# EAGLE design msp430f5528 (EAGLE 5.11)
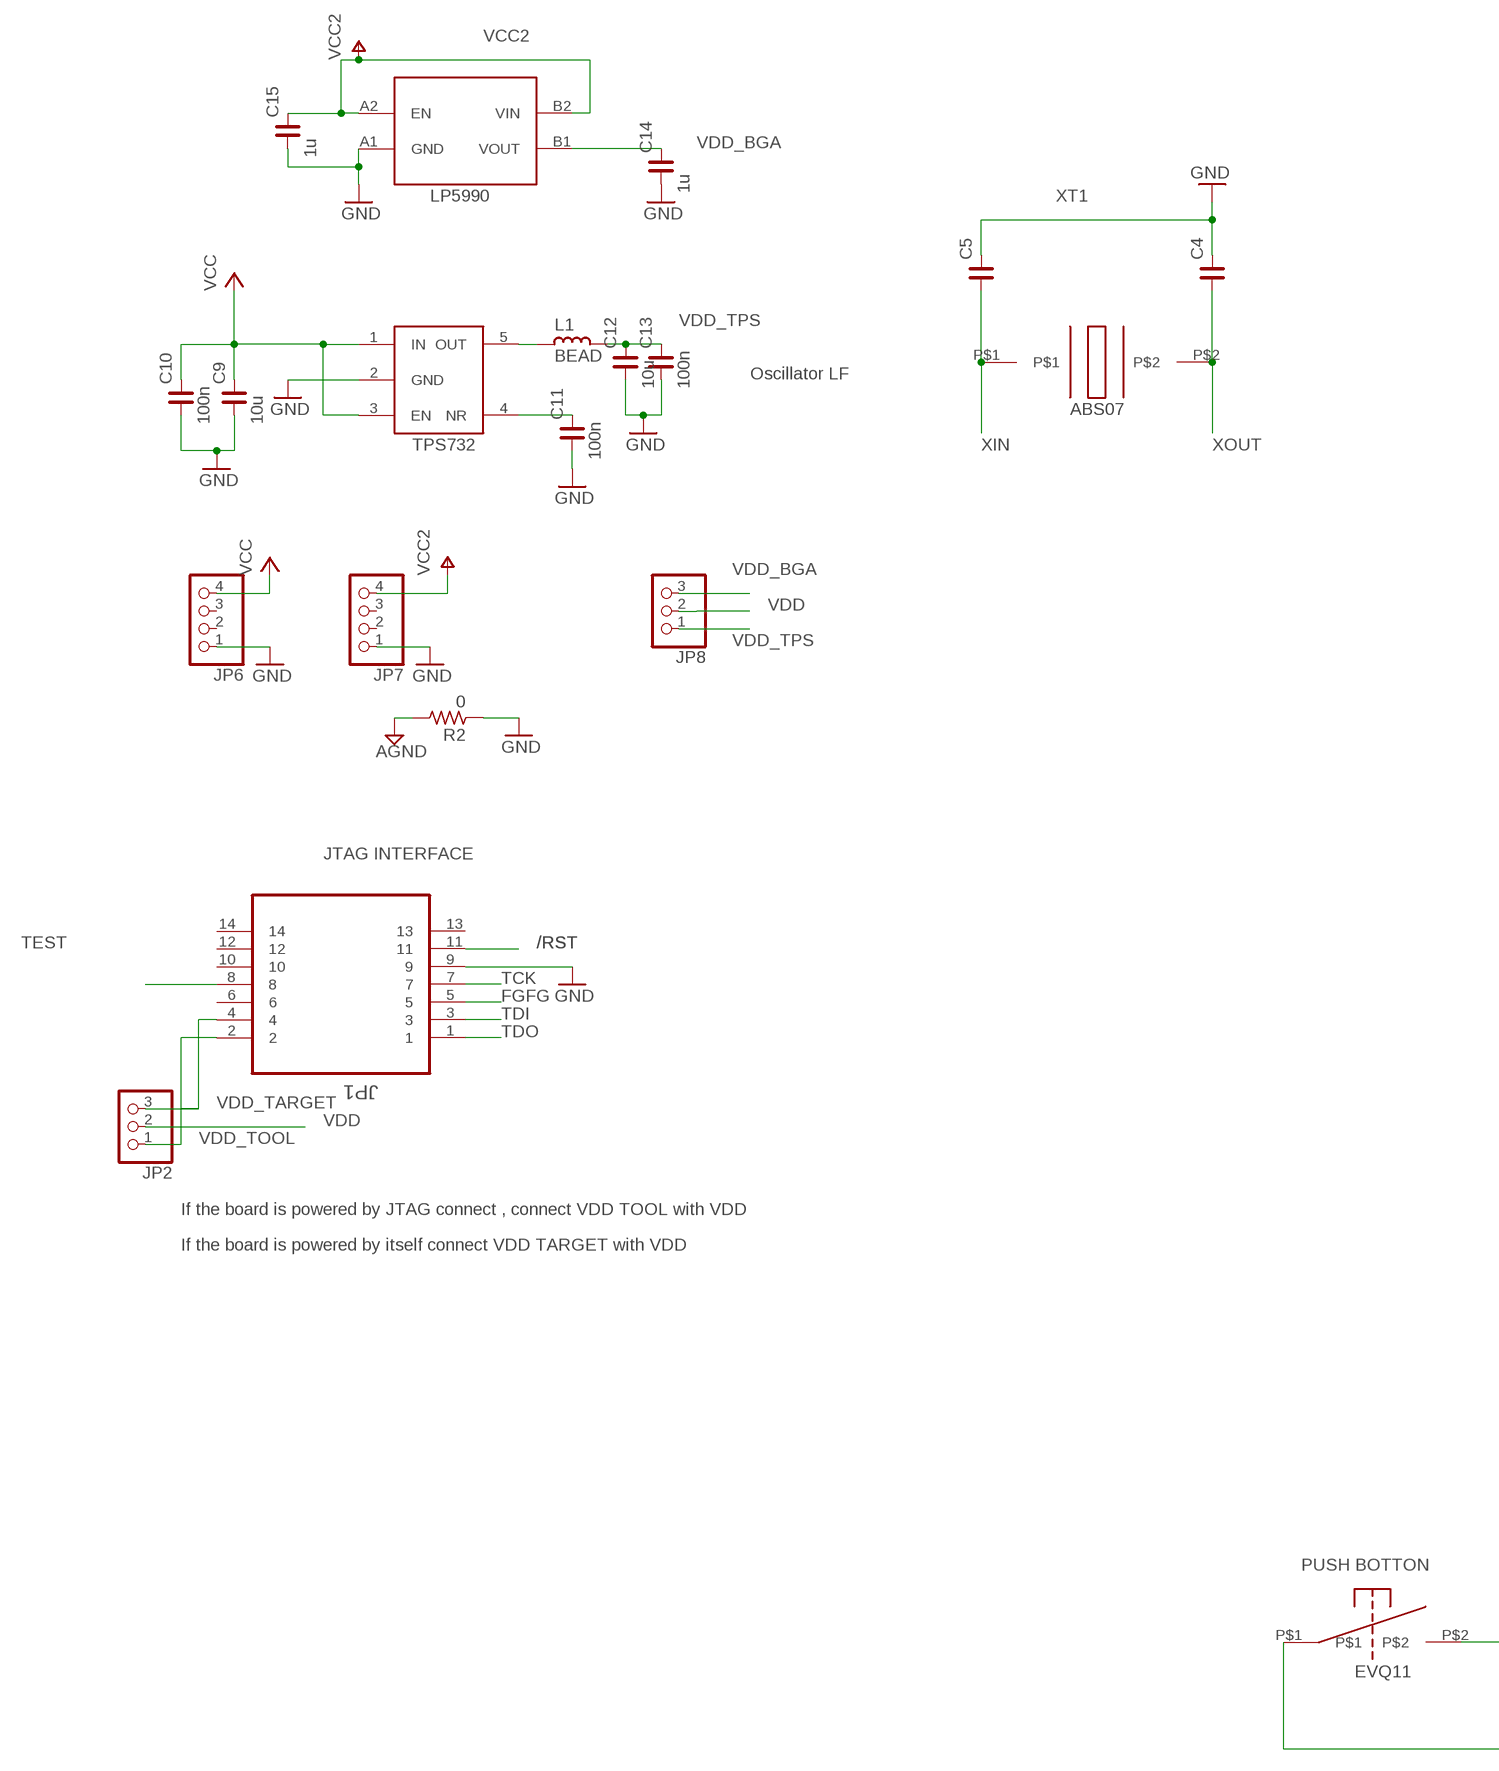
[diagram p0: schematic, sheet 1, part 1 of 2]
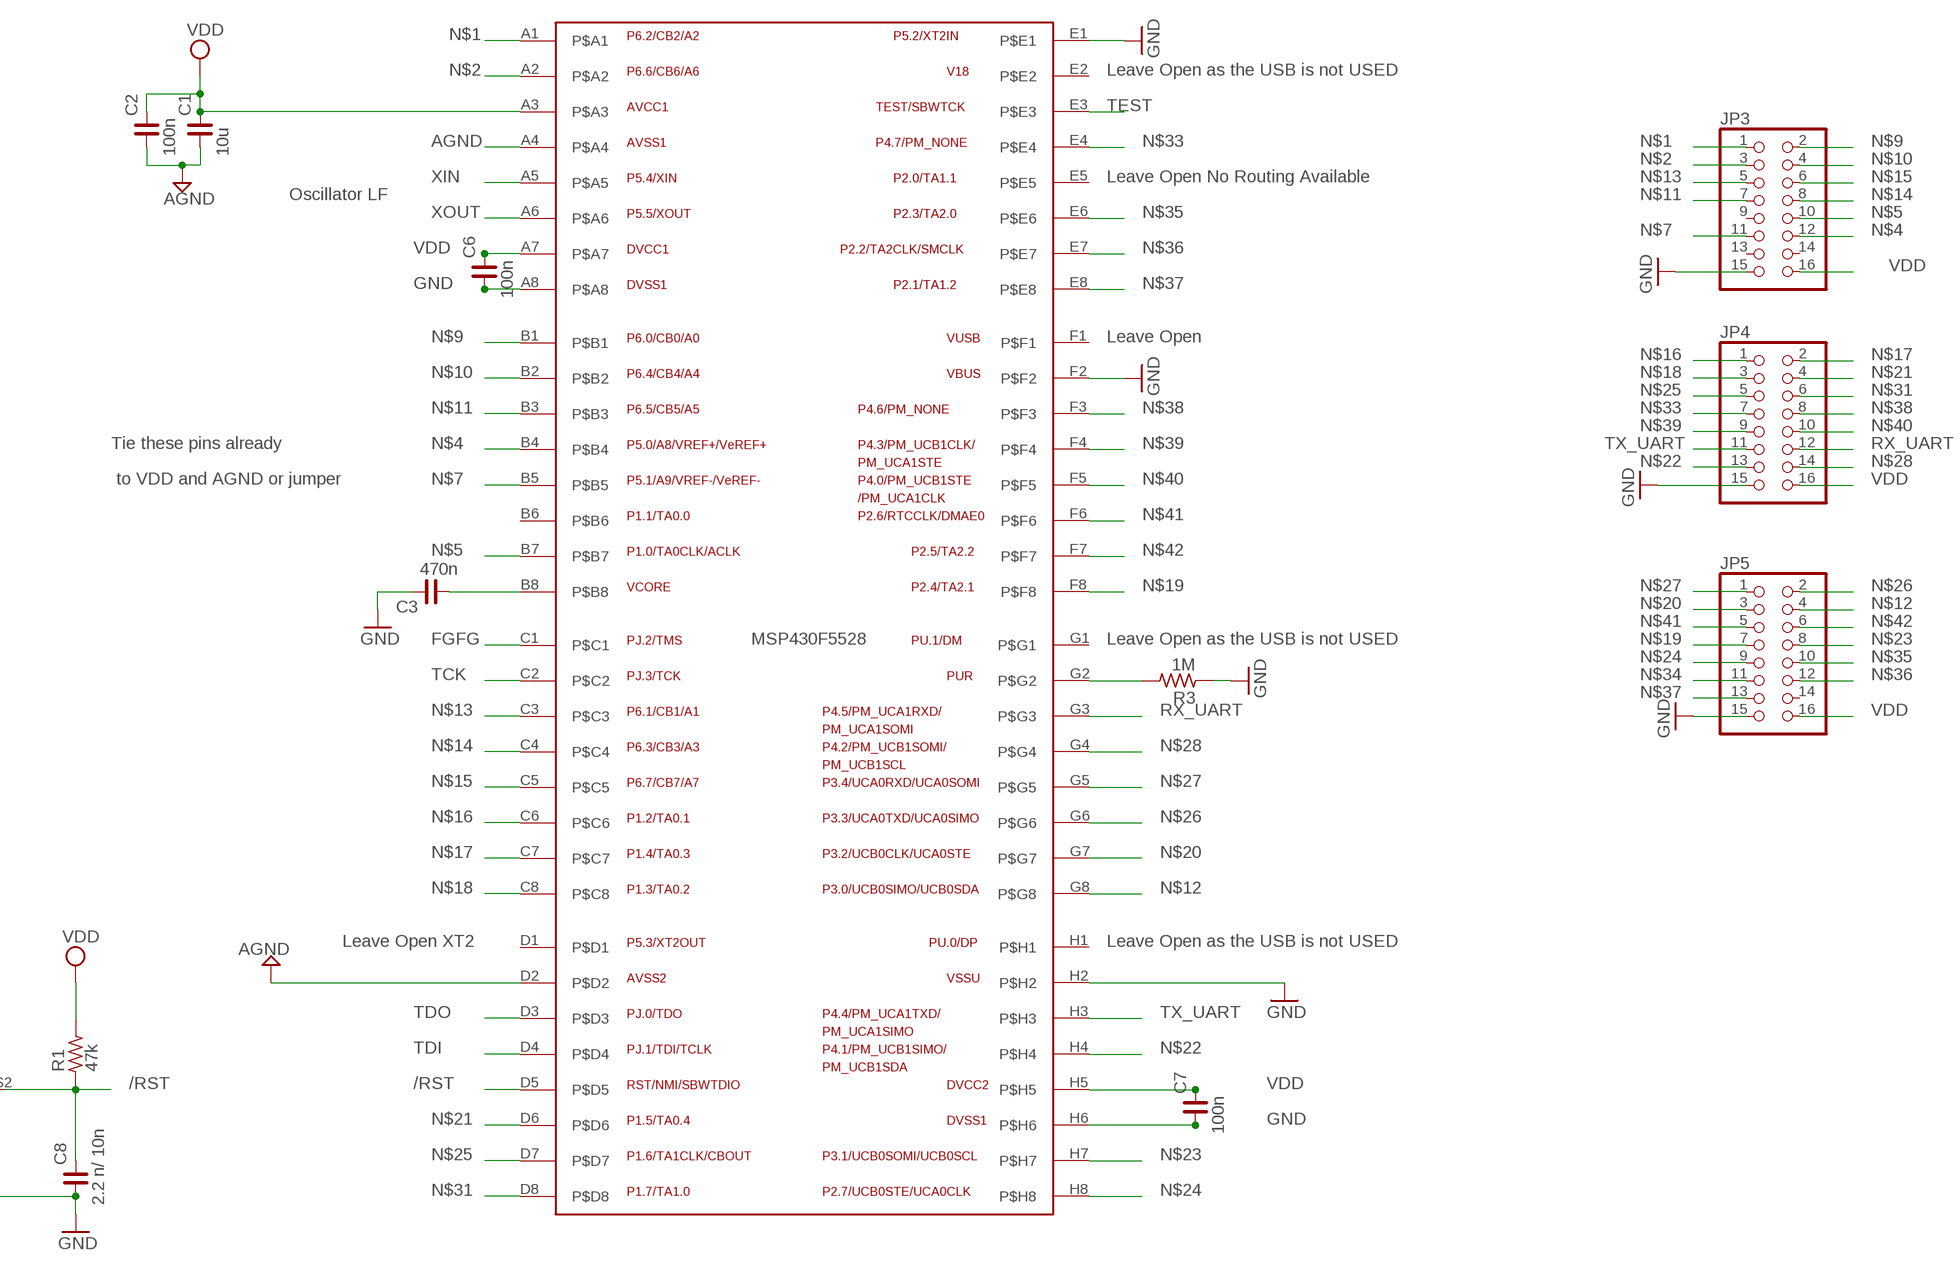
[diagram p1: schematic, sheet 1, part 2 of 2]

## Parts
C1  10u  C_0402  [C0402]
C2  100n  C_0201  [C0201]
C3  470n  C_0201  [C0201]
C4  C_0402  [C0402]
C5  C_0402  [C0402]
C6  100n  C_0201  [C0201]
C7  100n  C_0201  [C0201]
C8  2.2 n/ 10n  C_0201  [C0201]
C9  10u  C_0402  [C0402]
C10  100n  C_0201  [C0201]
C11  100n  C_0402  [C0402]
C12  10u  C_0201  [C0201]
C13  100n  C_0201  [C0201]
C14  1u  C_0402  [C0402]
C15  1u  C_0402  [C0402]
JP1  5103308-2  [TYCO_5103308-2]
JP2  PINHD-1X3  [1X03]
JP3  PINHD-2X8  [2X08]
JP4  PINHD-2X8  [2X08]
JP5  PINHD-2X8  [2X08]
JP6  PINHD-1X4  [1X04]
JP7  PINHD-1X4  [1X04]
JP8  PINHD-1X3  [1X03]
L1  BEAD  L_0402  [L0402]
R1  47k  R_0201  [R0201]
R2  0  R_0201  [R0201]
R3  1M  R_0201  [R0201]
TPS7323  TPS732XX  [SOT23]
U$1  MSP430F5528  [YFF64]
U$2  OSC32K  [ABS07]
U$3  LP5990  [XBGA4]
U$4  PUSH_BOT  [EVQ_11_TH]

## Nets
/RST: C8.2 JP1.11 R1.1 U$1.D5(P$D5) U$4.P$2
AGND: C1.1 C2.1 R2.2 U$1.A4(P$A4) U$1.D2(P$D2)
FGFG: JP1.5 U$1.C1(P$C1)
GND: C3.2 C4.2 C5.2 C6.1 C7.1 C8.1 C9.1 C10.1 C11.1 C12.1 C13.1 C14.1 C15.1 JP1.9 JP3.15 JP4.15 JP5.15 JP6.1 JP7.1 R2.1 R3.1 TPS7323.2(GND) U$1.A8(P$A8) U$1.E1(P$E1) U$1.F2(P$F2) U$1.H2(P$H2) U$1.H6(P$H6) U$3.A1(GND) U$4.P$1
N$1: JP3.1 U$1.A1(P$A1)
N$2: JP3.3 U$1.A2(P$A2)
N$3: C3.1 U$1.B8(P$B8)
N$4: JP3.12 U$1.B4(P$B4)
N$5: JP3.10 U$1.B7(P$B7)
N$7: JP3.11 U$1.B5(P$B5)
N$9: JP3.2 U$1.B1(P$B1)
N$10: JP3.4 U$1.B2(P$B2)
N$11: JP3.7 U$1.B3(P$B3)
N$12: JP5.4 U$1.G8(P$G8)
N$13: JP3.5 U$1.C3(P$C3)
N$14: JP3.8 U$1.C4(P$C4)
N$15: JP3.6 U$1.C5(P$C5)
N$16: JP4.1 U$1.C6(P$C6)
N$17: JP4.2 U$1.C7(P$C7)
N$18: JP4.3 U$1.C8(P$C8)
N$19: JP5.7 U$1.F8(P$F8)
N$20: JP5.3 U$1.G7(P$G7)
N$21: JP4.4 U$1.D6(P$D6)
N$22: JP4.13 U$1.H4(P$H4)
N$23: JP5.8 U$1.H7(P$H7)
N$24: JP5.9 U$1.H8(P$H8)
N$25: JP4.5 U$1.D7(P$D7)
N$26: JP5.2 U$1.G6(P$G6)
N$27: JP5.1 U$1.G5(P$G5)
N$28: JP4.14 U$1.G4(P$G4)
N$29: R3.2 U$1.G2(P$G2)
N$31: JP4.6 U$1.D8(P$D8)
N$33: JP4.7 U$1.E4(P$E4)
N$34: JP5.11
N$35: JP5.10 U$1.E6(P$E6)
N$36: JP5.12 U$1.E7(P$E7)
N$37: JP5.13 U$1.E8(P$E8)
N$38: JP4.8 U$1.F3(P$F3)
N$39: JP4.9 U$1.F4(P$F4)
N$40: JP4.10 U$1.F5(P$F5)
N$41: JP5.5 U$1.F6(P$F6)
N$42: JP5.6 U$1.F7(P$F7)
N$47: C11.2 TPS7323.4(NR)
N$48: L1.2 TPS7323.5(OUT)
RX_UART: JP4.12 U$1.G3(P$G3)
TCK: JP1.7 U$1.C2(P$C2)
TDI: JP1.3 U$1.D4(P$D4)
TDO: JP1.1 U$1.D3(P$D3)
TEST: JP1.8 U$1.E3(P$E3)
TX_UART: JP4.11 U$1.H3(P$H3)
VCC: C9.2 C10.2 JP6.4 TPS7323.1(IN) TPS7323.3(EN)
VCC2: C15.2 JP7.4 U$3.A2(EN) U$3.B2(VIN)
VDD: C1.2 C2.2 C6.2 C7.2 JP2.2 JP3.16 JP4.16 JP5.16 JP8.2 R1.2 U$1.A3(P$A3) U$1.A7(P$A7) U$1.H5(P$H5)
VDD_BGA: C14.2 JP8.3 U$3.B1(VOUT)
VDD_TARGET: JP1.4 JP2.3
VDD_TOOL: JP1.2 JP2.1
VDD_TPS: C12.2 C13.2 JP8.1 L1.1
XIN: C5.1 U$1.A5(P$A5) U$2.P$1
XOUT: C4.1 U$1.A6(P$A6) U$2.P$2
Unconnected: JP1.6 JP1.10 JP1.12 JP1.13 JP1.14 JP3.9 JP3.13 JP3.14 JP5.14 JP6.2 JP6.3 JP7.2 JP7.3 U$1.B6(P$B6) U$1.D1(P$D1) U$1.E2(P$E2) U$1.E5(P$E5) U$1.F1(P$F1) U$1.G1(P$G1) U$1.H1(P$H1)

## Notes on the sheet
- XT1
- Oscillator LF
- Leave Open as the USB is not USED
- Leave Open No Routing Available
- Oscillator LF
- JTAG INTERFACE
- Leave Open
- Tie these pins already
- to VDD and AGND or jumper
- Leave Open as the USB is not USED
- If the board is powered by JTAG connect , connect VDD TOOL with VDD
- If the board is powered by itself connect VDD TARGET with VDD
- Leave Open XT2 | Leave Open as the USB is not USED
- PUSH BOTTON

## Library data of the parts
C1-C15 = rc-master-smd:C_: NON-POLARIZED CAP
JP1 = TE_CONNECTOR:5103308-2: HEADER, 2.54MM, 14WAY; MPN: 5103308-2; OC_FARNELL: 1772816; OC_NEWARK: 73K2063; PACKAGE: HEADER, 2.54MM, 14WAY; SUPPLIER: Tyco Electronics
JP2 JP8 = pinhead:PINHD-1X3: PIN HEADER
JP3-JP5 = pinhead:PINHD-2X8: PIN HEADER
JP6 JP7 = pinhead:PINHD-1X4: PIN HEADER
L1 = rc-master-smd:L_: INDUCTOR
R1-R3 = rc-master-smd:R_: RESISTOR
TPS7323 = TPS732xx:TPS732XX
U$1 = msp430f5528:MSP430F5528
U$2 = ABS07:OSC32K
U$3 = LP5990:LP5990
U$4 = push_botton:PUSH_BOT

## Board
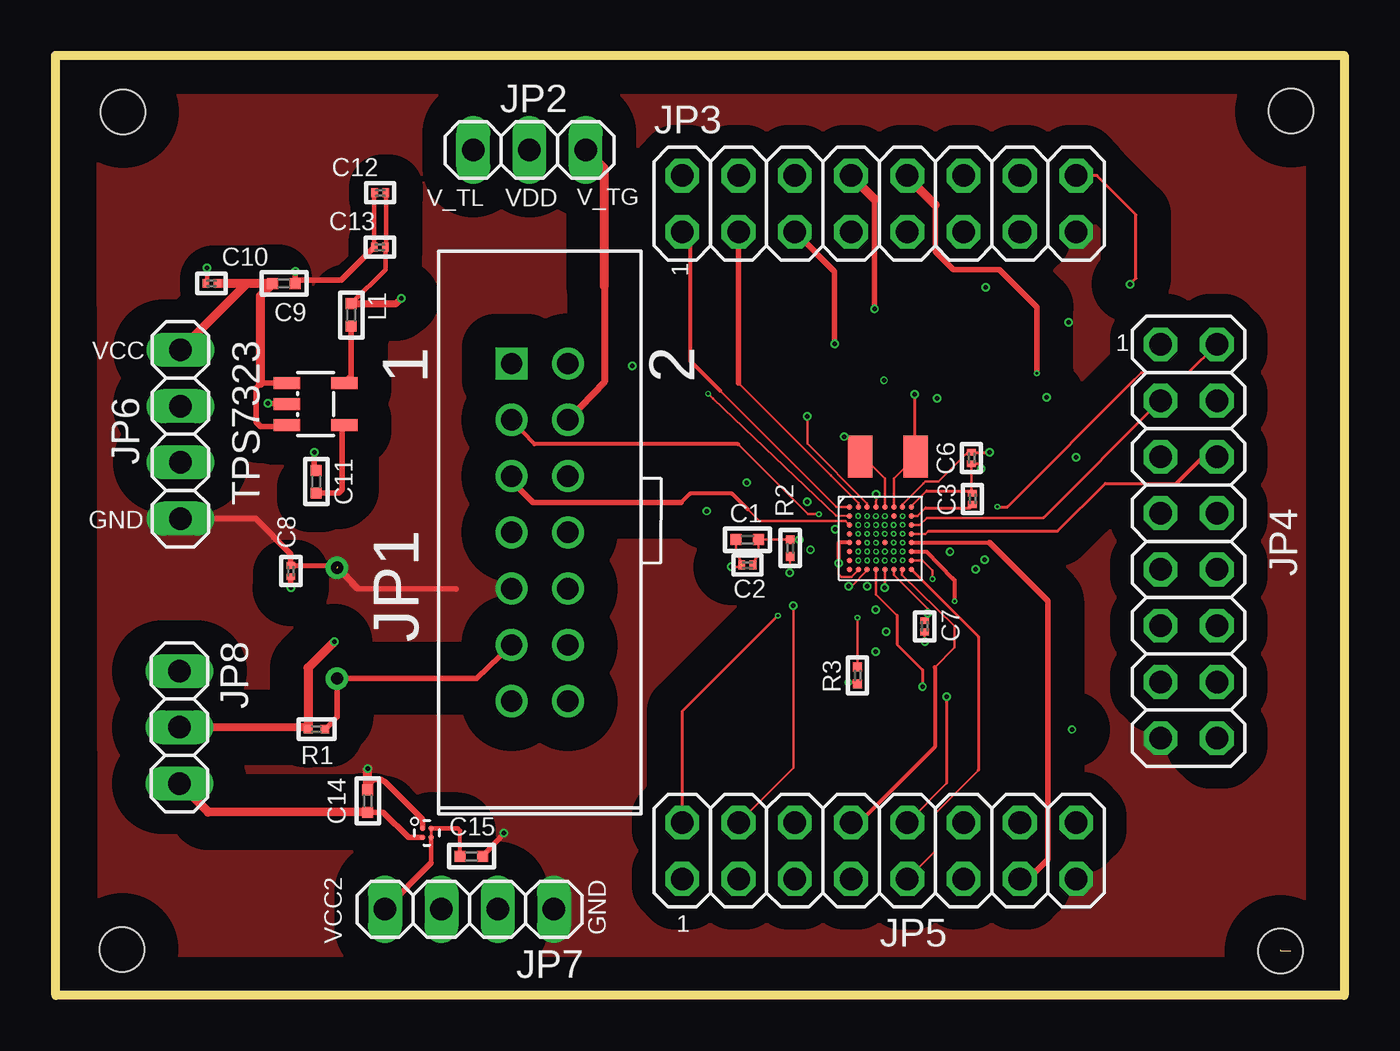
[diagram p2: board, top side]
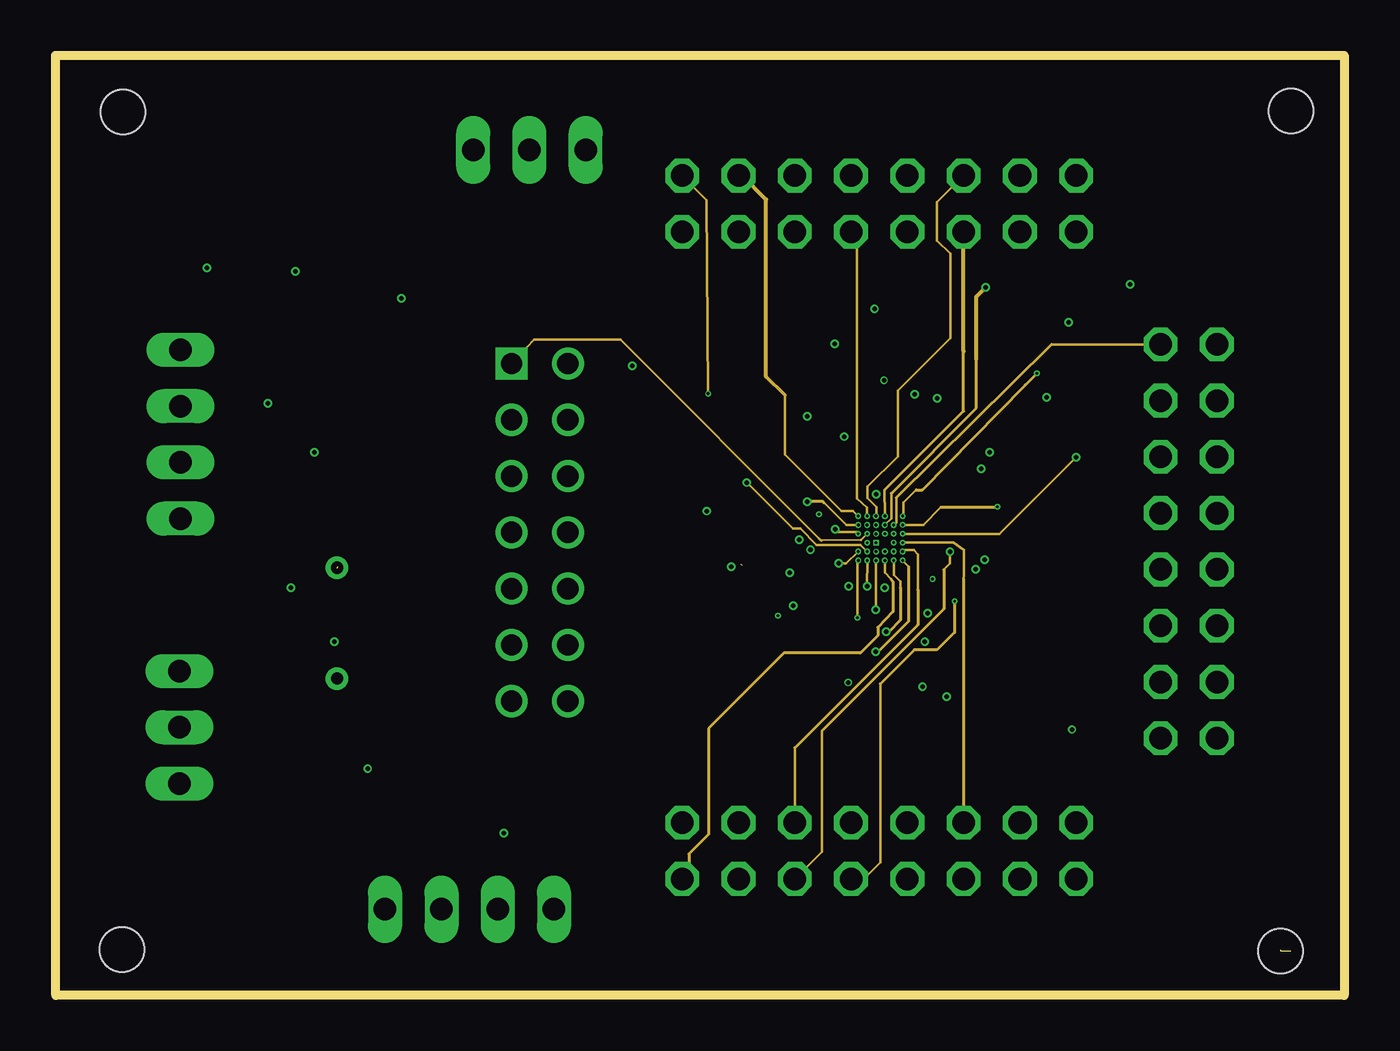
[diagram p3: board, inner layer Route2]
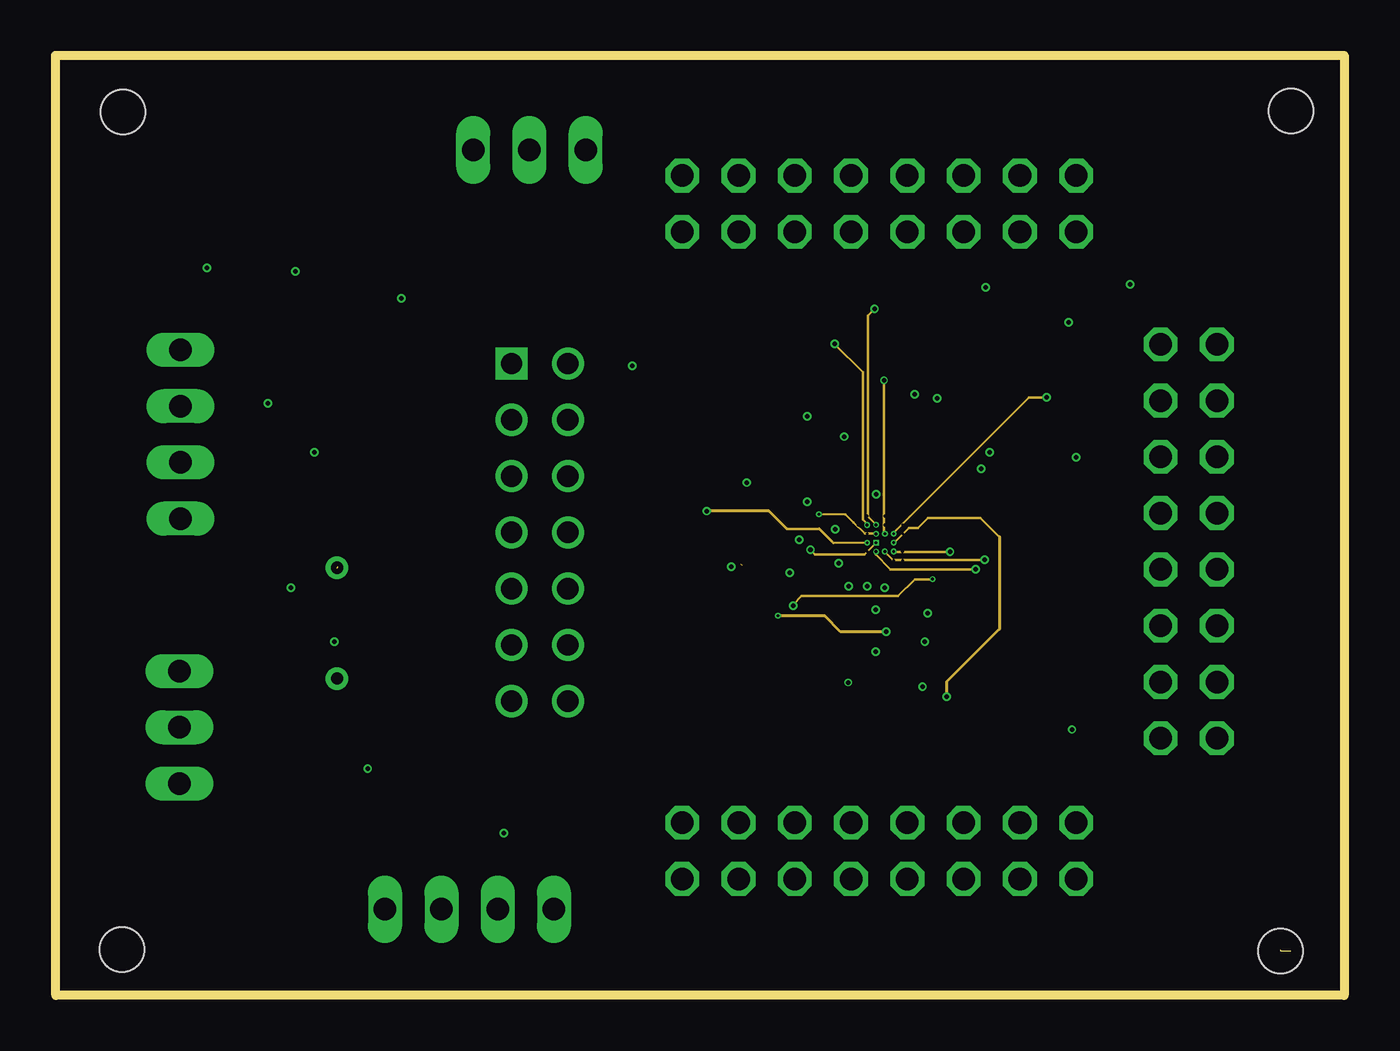
[diagram p4: board, inner layer Route3]
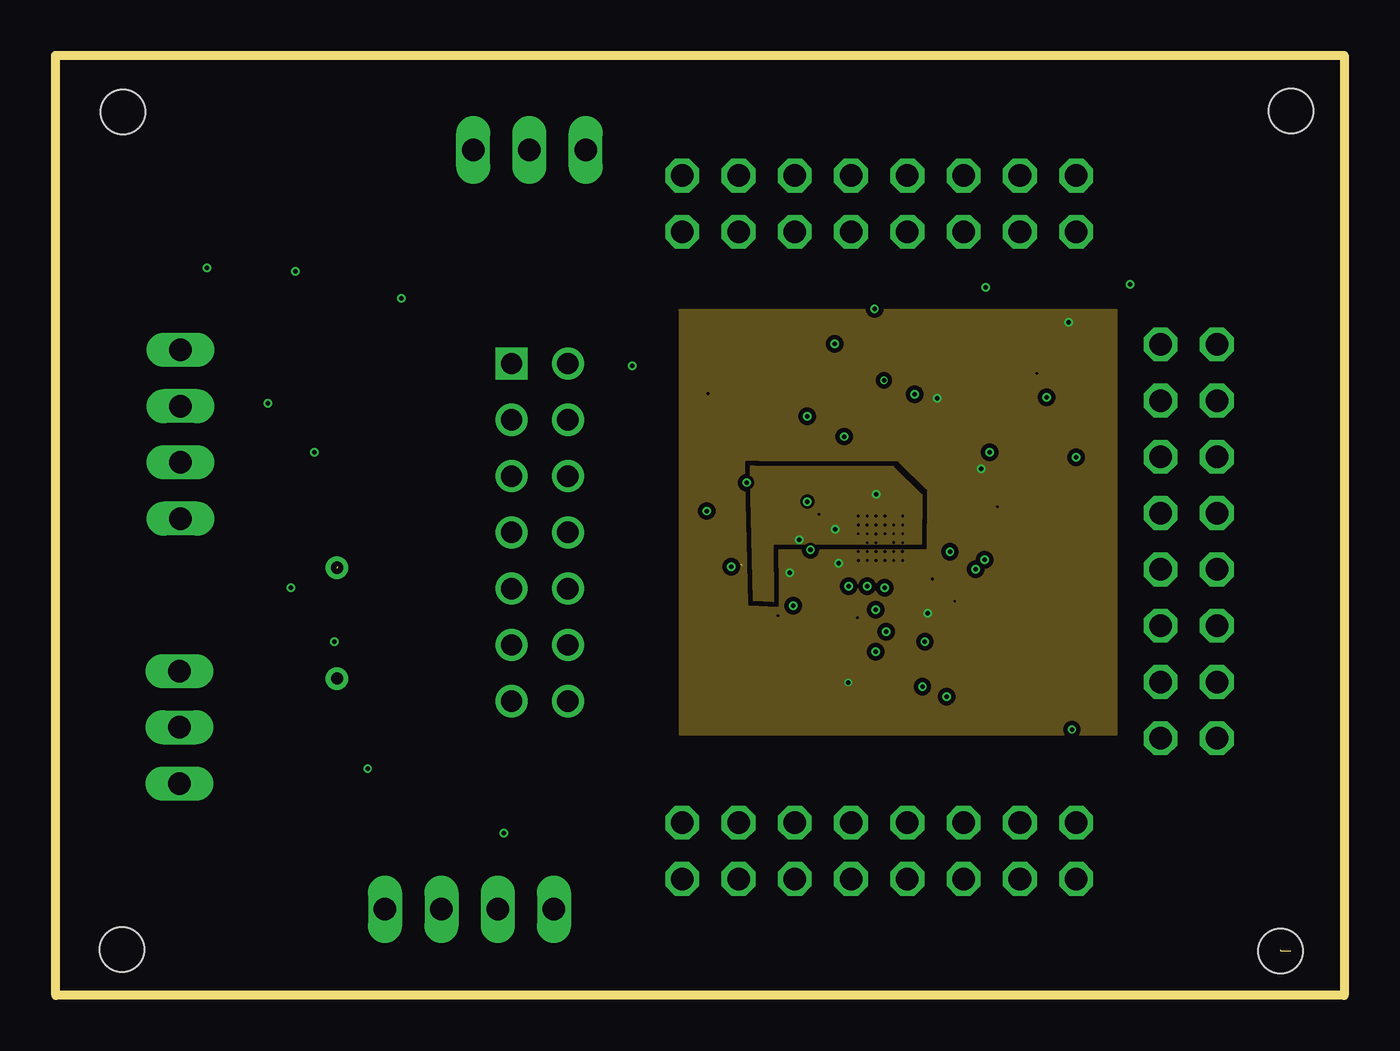
[diagram p5: board, inner layer Route14]
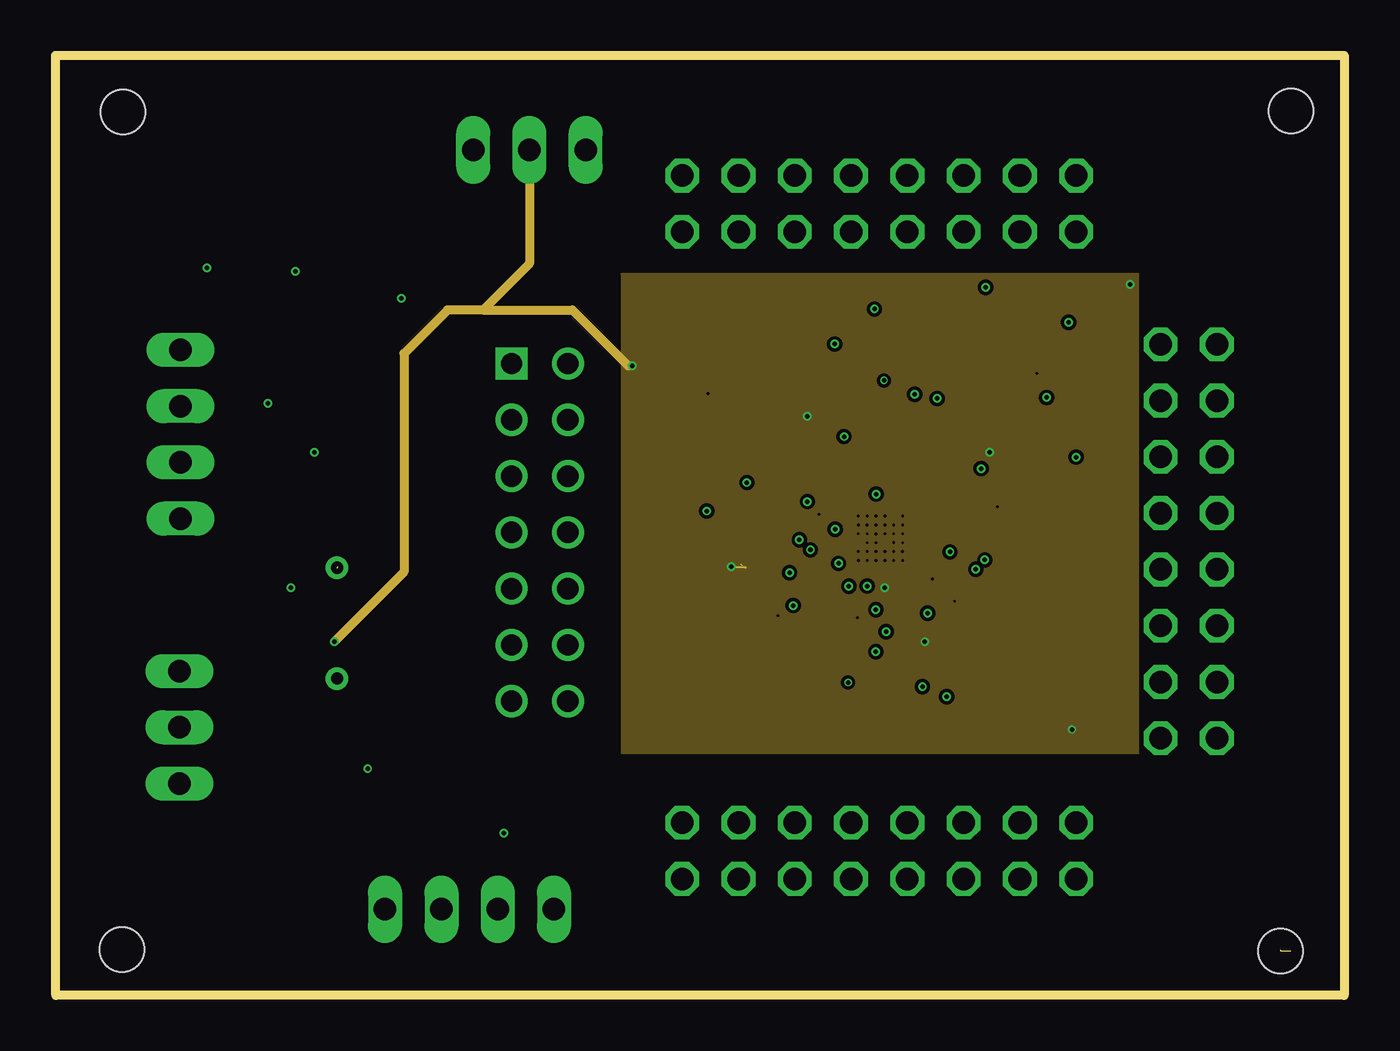
[diagram p6: board, inner layer Route15]
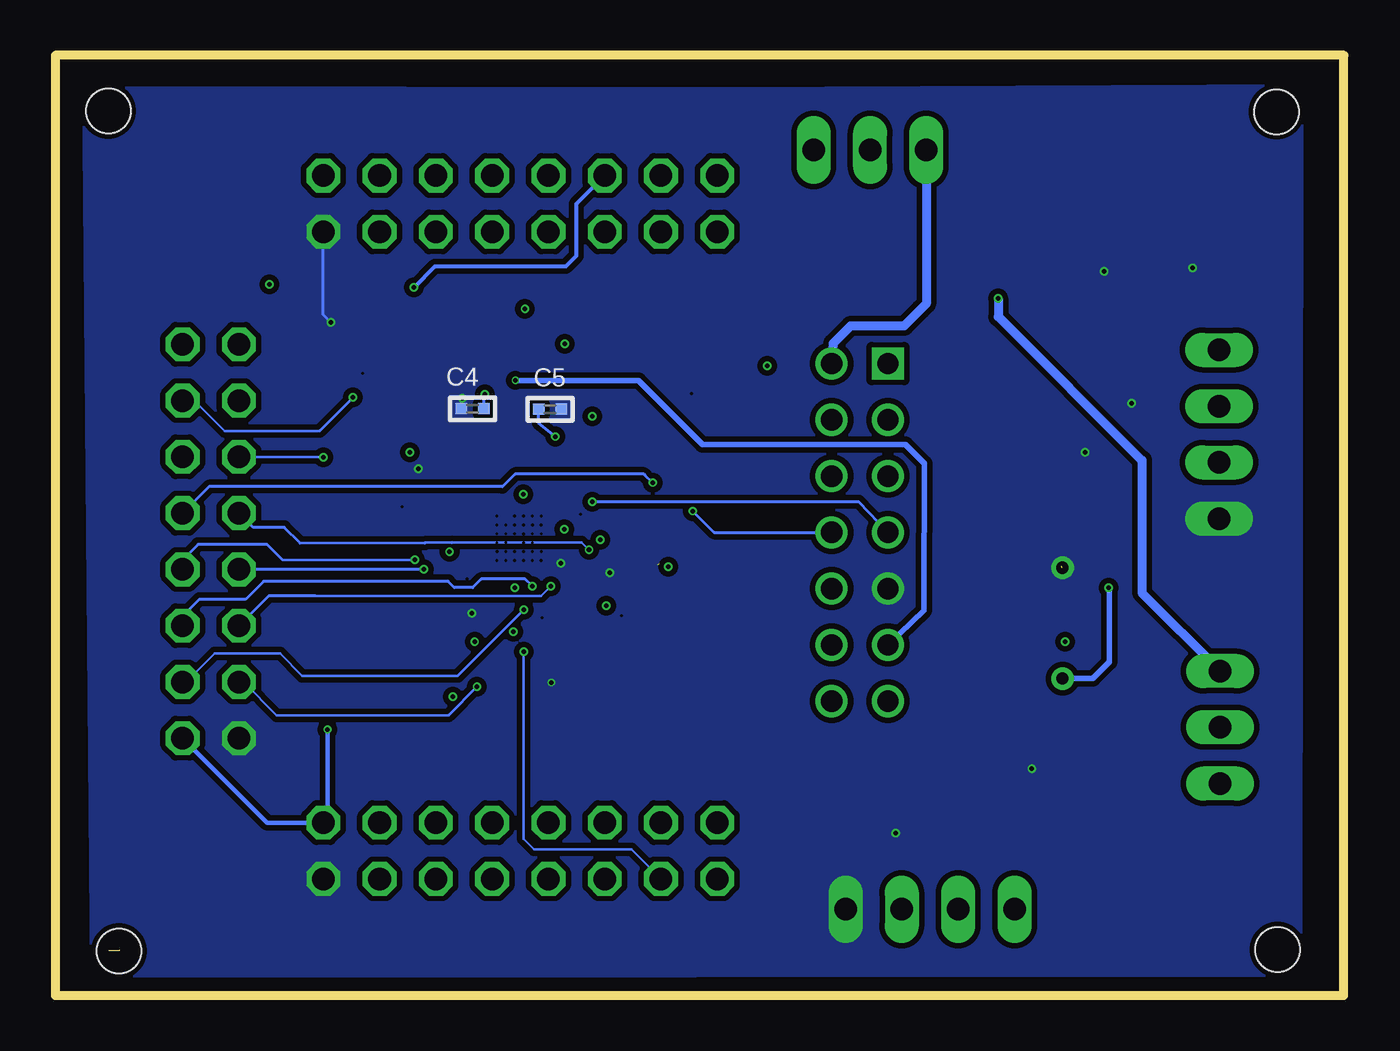
[diagram p7: board, bottom side, seen from below]

Size 58.17 x 42.44 mm. Coordinates in mm from the lower left corner, seen from the top.
Outline: 0,42.44 58.17,42.44 58.17,0 0.02,0 0.02,42.42
Outline: 55.28,2.07 55.28,2.02 55.75,2.02
Copper layers ([2:1+[3:2+(3*14)+15:14]+16:15]): Top 0.025mm / dielectric 0.1mm / Route2 0.022mm / dielectric 0.13mm / Route3 0.022mm / dielectric 0.1mm / Route14 0.022mm / dielectric 0.13mm / Route15 0.022mm / dielectric 0.13mm / Bottom 0.025mm
Design rules "6default *": minimum track width 4mil, minimum drill 5mil, track to track 0.1041mm, track to pad 4mil, pad to pad 4mil, via to via 4mil, smd to smd 0mil, copper to edge 0.1mm, drill to drill 0.1mm, minimum pad ring 2.5mil, minimum via ring 2.5mil, stop-mask expansion 0mil, vias tented up to drill 3mm, thermal gap 0mil
Holes 2 mm at 3.05,39.89 55.78,39.93 55.3,2.01 3.01,2.08

### Footprints (pad centres in the part's own frame; a part is rotated, then mirrored left to right if it is on the bottom)
C0402 = smd 0.5 x 0.5: 1 -0.508,0; 2 0.508,0
C0201 = smd 0.3 x 0.4: 1 -0.254,0; 2 0.254,0
TYCO_5103308-2 = drill 0.965 square: 1 0,2.54 | drill 0.965 round: 2 0,0; 3 -2.54,2.54; 4 -2.54,0; 5 -5.08,2.54; 6 -5.08,0; 7 -7.62,2.54; 8 -7.62,0; 9 -10.16,2.54; 10 -10.16,0; 11 -12.7,2.54; 12 -12.7,0; 13 -15.24,2.54; 14 -15.24,0
1X03 = drill 1.016 long: 1 -2.54,0; 2 0,0; 3 2.54,0
2X08 = drill 1.016 octagon: 1 -8.89,-1.27; 2 -8.89,1.27; 3 -6.35,-1.27; 4 -6.35,1.27; 5 -3.81,-1.27; 6 -3.81,1.27; 7 -1.27,-1.27; 8 -1.27,1.27; 9 1.27,-1.27; 10 1.27,1.27; 11 3.81,-1.27; 12 3.81,1.27; 13 6.35,-1.27; 14 6.35,1.27; 15 8.89,-1.27; 16 8.89,1.27
1X04 = drill 1.016 long: 1 -3.81,0; 2 -1.27,0; 3 1.27,0; 4 3.81,0
L0402 = smd 0.5 x 0.5: 1 -0.508,0; 2 0.508,0
R0201 = smd 0.4 x 0.4: 1 -0.381,0; 2 0.381,0
SOT23 = smd 0.55 x 1.2: 1 -0.95,-1.3; 2 0,-1.3; 3 0.95,-1.3; 4 0.95,1.3; 5 -0.95,1.3
YFF64 = smd 0.25 x 0.25: A1 -1.4,1.4; A2 -1,1.4; A3 -0.6,1.4; A4 -0.2,1.4; A5 0.2,1.4; A6 0.6,1.4; A7 1,1.4; A8 1.4,1.4; B1 -1.4,1; B2 -1,1; B3 -0.6,1; B4 -0.2,1; B5 0.2,1; B6 0.6,1; B7 1,1; B8 1.4,1; C1 -1.4,0.6; C2 -1,0.6; C3 -0.6,0.6; C4 -0.2,0.6; C5 0.2,0.6; C6 0.6,0.6; C7 1,0.6; C8 1.4,0.6; D1 -1.4,0.2; D2 -1,0.2; D3 -0.6,0.2; D4 -0.2,0.2; D5 0.2,0.2; D6 0.6,0.2; D7 1,0.2; D8 1.4,0.2; E1 -1.4,-0.2; E2 -1,-0.2; E3 -0.6,-0.2; E4 -0.2,-0.2; E5 0.2,-0.2; E6 0.6,-0.2; E7 1,-0.2; E8 1.4,-0.2; F1 -1.4,-0.6; F2 -1,-0.6; F3 -0.6,-0.6; F4 -0.2,-0.6; F5 0.2,-0.6; F6 0.6,-0.6; F7 1,-0.6; F8 1.4,-0.6; G1 -1.4,-1; G2 -1,-1; G3 -0.6,-1; G4 -0.2,-1; G5 0.2,-1; G6 0.6,-1; G7 1,-1; G8 1.4,-1; H1 -1.4,-1.4; H2 -1,-1.4; H3 -0.6,-1.4; H4 -0.2,-1.4; H5 0.2,-1.4; H6 0.6,-1.4; H7 1,-1.4; H8 1.4,-1.4
ABS07 = smd 1.1 x 1.9: P$1 -1.25,0; P$2 1.25,0
XBGA4 = smd 0.25 x 0.25: A1 -0.2,-0.2; A2 -0.2,0.2; B1 0.2,-0.2; B2 0.2,0.2
EVQ_11_TH = drill 0.55 pad 1.016 round: P$1 -2.5,0; P$2 2.5,0

### Placement (x,y rotation side)
C1  31.23,20.58 180 top
C2  31.23,19.43 180 top
C3  41.39,22.42 90 top
C4  39.34,26.49 180 bottom
C5  35.84,26.47 0 bottom
C6  41.35,24.26 90 top
C7  39.23,16.66 270 top
C8  10.63,19.16 270 top
C9  10.32,32.14 180 top
C10  7.05,32.15 0 top
C11  11.77,23.19 270 top
C12  14.66,36.24 0 top
C13  14.64,33.78 0 top
C14  14.1,8.78 270 top
C15  18.78,6.29 180 top
JP1  23.13,28.53 90 top
JP2  21.4,38.17 0 top
JP3  37.18,35.74 0 top
JP4  51.15,20.5 270 top
JP5  37.18,6.53 0 top
JP6  5.64,25.34 90 top
JP7  18.69,3.89 180 top
JP8  5.6,12.11 270 top
L1  13.35,30.72 270 top
R1  11.78,12.02 180 top
R2  33.17,20.2 90 top
R3  36.21,14.45 90 top
TPS7323  11.74,26.7 270 top
U$1  37.24,20.64 0 top
U$2  37.58,24.33 0 top
U$3  16.77,7.34 270 top
U$4  12.71,16.81 270 top

### Tracks (layer width: path | path; a pad name or v marks a point on that pad's centre or on a via)
/RST  (via drill 0.13 pad 0.25 layers 1-2, 0.13 pad 0.25 layers 2-3, 0.2, 0.2 pad 0.38)
  Top 0.102: U$1.D5 v37.44,20.84
  Top 0.127: C8.2
  Top 0.254: R1.1 12.71,12.57 U$4.P$2 19.01,14.31 JP1.11 | v10.62,18.41 C8.2
  Route2 0.102: v37.44,20.84 U$1.D5
  Route3 0.089: v37.4,27.76
  Route3 0.102: U$1.D5 37.4,20.89 37.4,20.98 37.4,21.01 v37.4,27.76
  Bottom 0.127: 10.6,18.38 v10.62,18.41
  Bottom 0.254: v37.4,27.76 31.85,27.76 28.95,24.86 19.79,24.86 18.95,24.02 18.96,17.76 18.96,17.39 JP1.11 | 10.6,18.38 10.6,15.05 11.34,14.31 U$4.P$2
  other vias: 37.44,20.84
AGND  (via drill 0.13 pad 0.25 layers 1-2, 0.2 pad 0.38)
  Top 0.076: R2.2
  Top 0.102: U$1.A4 v37.05,22.63 | R2.2 32.31,20.58 C1.1 31.74,20 C2.1 | U$1.D2 | U$1.D2 v36.24,20.84 | R2.2 v33.58,20.57
  Top 0.135: R2.2
  Route2 0.102: v36.23,20.84 36.16,20.91 35.34,20.91 v35.2,21.05
  Route2 0.127: v36.24,20.84 v36.23,20.84
  Bottom 0.102: v37.05,22.63 37.04,22.5 v37.05,22.63
  pour Route14 (isolate 0.127, rank 2): 31.43,22.51 31.53,17.86 32.38,17.81 32.36,20.4 39.06,20.4 39.08,22.59 37.8,23.86 31.54,23.88 31.4,23.87 31.41,22.96
FGFG
  Top 0.089: U$1.C1 35.83,21.25
  Top 0.102: 31.24,21.96 31.78,21.42 35.28,21.42 35.66,21.42 U$1.C1
  Top 0.178: 28.24,22.26 28.65,22.66 30.54,22.66 31.24,21.96
  Top 0.254: JP1.5 20.53,23.3 21.56,22.26 28.24,22.26
GND  (via drill 0.13 layers 1-2, 0.2 pad 0.25, 0.2 pad 0.38)  (1 unrouted)
  Top 0.076: v10.82,32.68 v10.83,32.69
  Top 0.089: C7.1 39.25,16.93
  Top 0.102: U$1.A8 38.64,22.1 39.32,22.78 | U$1.H2 36.26,19.27 36.26,19.22 35.93,18.89 35.48,18.89 35.35,19.03 v35.35,19.51 | U$1.F2 v36.24,20.04 | U$1.H6 37.84,18.99 39.37,17.46 v39.37,17.26 39.37,17.06 C7.1 | 41.39,22.78 41.35,22.82 C6.1 | R2.1 33.16,19.11 v33.14,19.08
  Top 0.127: 39.32,22.78 41.39,22.78 C3.2 | v45.73,30.38 45.72,30.38 45.71,30.39 | C6.1 41.78,24.01 v41.78,23.79 | R3.1 36.15,14.13 v35.78,14.13 | U$4.P$1 12.64,19.38
  Top 0.178: U$1.E1 35.35,20.44 v35.35,19.51
  Top 0.203: C11.1 11.64,23.83 | C10.1 6.84,32.12 v6.84,32.84 | 10.97,32.29 C9.1 | 14.39,36.22 C13.1
  Top 0.254: 18.09,18.36 13.59,18.37 U$4.P$1 | 12.64,19.38 C8.1 10.63,19.94 9.04,21.52 JP6.1 | C9.1 v10.82,32.68 | C12.1 14.39,36.22 | 12.76,19.36 13.64,18.43 | v11.68,24.53 11.68,23.79 arc90 C11.1 | v9.6,26.72 10.41,26.72 arc-90 TPS7323.2 | C15.1 20.22,7.3 v20.25,7.33 | U$3.A1 16.57,7.95 14.88,9.64 arc138 C14.1 | 10.97,32.29 12.9,32.29 C13.1
  Top 0.406: v14.09,10.25 v14.1,10.24 C14.1
  Route2 0.089: v36.23,20.05 v36.24,20.04
  Route2 0.102: v36.23,20.05 35.69,19.51 v35.35,19.51
  Bottom 0.102: C4.2 39.77,26.57
  Bottom 0.127: JP3.15 46.07,30.73 v45.73,30.38 | 39.77,26.57 39.8,26.6 v39.8,26.95
  Bottom 0.203: v6.84,32.84 6.84,32.8
  pour Bottom (isolate 0.25): 27.73,40.93 56.92,40.98 56.55,0.87 1.93,0.92 1.88,41.08
  pour Route14 (isolate 0.203, rank 3): 28.18,30.93 47.89,30.93 47.89,11.79 28.19,11.79 28.19,30.91
  pour Top (isolate 1.524, rank 2): 27.8,40.99 56.98,41.05 56.61,0.93 1.99,0.98 1.94,41.14
N$1
  Top 0.102: U$1.A1 35.25,22.05 30.02,27.29
  Top 0.178: 30.02,27.29 28.66,28.64 28.66,29.19 28.66,34.1 JP3.1
N$2
  Top 0.102: U$1.A2 36.24,22.24 35,23.48 30.83,27.65
  Top 0.254: 30.83,27.65 JP3.3
N$3
  Top 0.102: U$1.B8 38.91,21.64 39.28,22.01
  Top 0.127: 39.28,22.01 39.28,22.02 41.24,22.02
  Top 0.178: 41.24,22.02 C3.1
N$4  (via drill 0.13 pad 0.25 layers 1-2)
  Top 0.102: U$1.B4 v37.04,21.64
  Route2 0.102: v37.04,21.64 37.03,21.65 37.05,21.6 37.05,22.05 36.65,22.45 36.65,22.96 36.66,22.97 38.02,24.33 38.02,24.45 38.02,27.31 40.39,29.68 40.39,33.48 39.8,34.07 39.8,35.82 JP3.12
N$5  (via drill 0.13 layers 1-2, 0.13 pad 0.25 layers 1-2)
  Top 0.102: U$1.B7 38.23,21.63 | U$1.B7 | JP3.10
  Top 0.127: 38.45,36.95 JP3.10
  Top 0.254: 39.72,35.68 39.72,33.57 40.52,32.77 42.62,32.77 44.3,31.09 v44.3,28.08
  Top 0.406: 39.72,35.68 38.45,36.95
  Route2 0.102: U$1.B7 38.27,21.67 38.27,22.25 38.84,22.83
  Route2 0.127: 38.84,22.83 39.12,22.83 43.78,27.56 v44.3,28.08
  other vias: 38.24,21.64
N$6
  pour Top (isolate 1.27): 11.15,27.82 12.34,27.82 12.34,25.08 11.14,25.08 11.14,27.81
  pour Top (isolate 2.032): 10.78,33.16 10.78,34.36 13.51,34.36 13.51,33.15 10.78,33.15
  pour Top (isolate 3.048): 14.6,19.65 13.4,19.65 13.4,22.39 14.6,22.39 14.6,19.66
N$7  (via drill 0.13 pad 0.25 layers 1-2)
  Top 0.102: U$1.B5
  Route2 0.1: U$1.B5
  Route2 0.102: 37.43,22.82 37.43,21.71 U$1.B5
  Route2 0.127: 40.99,29.08 40.99,26.38 37.43,22.82
  Route2 0.178: 40.99,29.08 JP3.11
  other vias: 37.44,21.64
N$8
  pour Top (isolate 1.27): 34.58,22.93 40.24,22.94 40.23,17.98 34.53,17.99 34.59,22.69
  pour Top (isolate 2.032): 44.79,33.53 47.57,33.53 47.55,28.75 44.76,28.69 44.79,33.29
  pour Top (isolate 3.81): 7.89,17.76 10.68,17.76 10.66,12.97 7.86,12.91 7.89,17.52
  pour Top (isolate 3.81): 7.73,9.63 7.64,10.56 12.42,10.54 12.59,9.56 7.99,9.6
N$9  (via drill 0.13 pad 0.25 layers 1-2)
  Top 0.102: U$1.B1 35.23,21.66 29.69,26.94 v29.46,27.17
  Route2 0.102: JP3.2 29.4,35.91 v29.46,27.17
N$10  (via drill 0.13 pad 0.25 layers 1-2)
  Top 0.102: U$1.B2 | U$1.B2 v36.23,21.65 v36.23,21.64 U$1.B2
  Route2 0.102: U$1.B2 v36.23,21.64 36.01,21.86 35.48,21.86 32.92,24.42 32.92,27.1
  Route2 0.165: 32.92,27.1 32.08,27.94
  Route2 0.178: 32.08,27.94 32.08,35.94 31,37.01 JP3.4
N$11  (via drill 0.13 pad 0.25 layers 1-2)
  Top 0.102: U$1.B3
  Route2 0.102: JP3.7 36.17,34.22 36.17,23.78 36.17,22.44 arc90 36.18,22.43 36.64,22.03 U$1.B3
  other vias: 36.64,21.64
N$12  (via drill 0.13 layers 2-3, 0.13 pad 0.25 layers 1-2, 0.2 pad 0.38)
  Top 0.102: v39.59,18.8 39.59,19.19 39.13,19.64 U$1.G8 | JP5.4 33.31,10.28 v33.31,17.6
  Route2 0.102: v39.59,18.8 v39.58,18.8 v39.59,18.8
  Route3 0.102: v39.59,18.8 v39.58,18.79 38.8,18.79 38.04,18.03 37.49,18.03 33.68,18.04 33.31,17.66 v33.31,17.6
N$13  (via drill 0.13 layers 1-2, 0.13 layers 2-3, 0.2 pad 0.38)
  Top 0.102: U$1.C3 v36.64,21.24
  Top 0.254: v35.17,29.41 35.17,32.68 JP3.5
  Route2 0.076: v36.64,21.24 U$1.C3 v36.64,21.24
  Route2 0.102: v36.64,21.24
  Route3 0.076: v36.64,21.24 36.69,21.25
  Route3 0.102: 36.69,21.25 36.44,21.5 36.44,22.82 36.44,28.14 v35.17,29.41
N$14  (via drill 0.13 layers 1-2, 0.13 layers 2-3, 0.2 pad 0.38)
  Top 0.102: U$1.C4
  Top 0.254: v36.97,30.99 36.97,35.96
  Top 0.406: 36.97,35.96 JP3.8
  Route2 0.076: U$1.C4
  Route2 0.102: U$1.C4
  Route3 0.076: U$1.C4 37.06,21.22 37.06,21.23
  Route3 0.102: 37.06,21.23 36.68,21.61 36.68,30.7 v36.97,30.99
  other vias: 37.04,21.24 37.04,21.24
N$15  (via drill 0.13 layers 1-2, 0.2 pad 0.38)
  Top 0.076: U$1.C5
  Top 0.102: U$1.C5
  Route2 0.076: U$1.C5
  Route2 0.089: U$1.C5
  Route2 0.102: U$1.C5 | U$1.C5 37.73,21.53 37.73,21.55 37.73,22.67
  Route2 0.127: 37.73,22.67 41.56,26.52 41.56,28.75
  Route2 0.178: 41.56,28.75 41.56,31.55 v41.98,31.97
  Bottom 0.178: v41.98,31.97 41.03,32.92 35.12,32.92 34.65,33.4 34.65,35.74 JP3.6
  other vias: 37.44,21.24
N$16  (via drill 0.13 layers 1-2)
  Top 0.102: U$1.C6
  Route2 0.102: U$1.C6 37.95,21.35 37.95,21.41 37.95,22.48 | 44.96,29.39 JP4.1
  Route2 0.127: 37.95,22.48 44.96,29.39
  other vias: 37.84,21.24
N$17  (via drill 0.13 layers 1-2)
  Top 0.102: U$1.C7 | U$1.C7 | 48.7,27.8 49.02,28.11
  Top 0.127: 48.7,27.8 42.96,22.06 v42.52,22.06 | 49.02,28.11 51.14,28.11 JP4.2
  Route2 0.102: U$1.C7 | U$1.C7 39.18,21.24 39.98,22.04 | 42.5,22.04 v42.52,22.06
  Route2 0.127: 39.98,22.04 42.5,22.04
  other vias: 38.24,21.24
N$18
  Top 0.102: U$1.C8 39.01,21.24 39.33,21.56 44.59,21.56
  Top 0.127: 44.59,21.56 JP4.3
N$19  (via drill 0.13 layers 1-2)
  Top 0.178: U$1.F8 39.31,20.04 40.5,18.84 40.59,18.75 v40.59,17.8
  Route2 0.102: JP5.7 36.48,5.26 37.23,6.01 37.23,13.98 37.23,14.07
  Route2 0.127: 37.23,14.07 38.77,15.6 39.79,15.6 40.58,16.38 40.59,16.39 v40.59,17.8
N$20  (via drill 0.13 layers 1-2, 0.2 pad 0.38)
  Top 0.102: U$1.G7
  Route2 0.102: U$1.G7 38.51,19.36
  Route2 0.127: 38.51,19.36 38.51,16.89 38.2,16.58 37.14,15.52 v37.03,15.52
  Bottom 0.102: JP5.3 32.17,6.6 36.57,6.6 37.03,7.07 v37.03,15.52
  other vias: 38.24,19.64
N$21  (via drill 0.13 layers 1-2, 0.13 layers 2-3, 0.2 pad 0.38)
  Top 0.102: U$1.D6
  Route2 0.076: U$1.D6 v37.84,20.84
  Route2 0.102: U$1.D6
  Route3 0.102: v37.84,20.84 37.82,20.87 43.94,27 v44.74,27
  Bottom 0.102: 46.24,25.49 50.53,25.49 51.9,26.85 JP4.4
  Bottom 0.127: v44.74,27 46.24,25.49
  other vias: 37.84,20.84
N$22  (via drill 0.2 pad 0.38)
  Top 0.102: 37.99,17.16 37.04,18.11 U$1.H4
  Top 0.127: v39.13,13.94 39.13,14.7 38.13,15.7 37.99,15.85 37.99,17.16
  Bottom 0.102: 40.43,12.65 48.18,12.65 49.68,14.15 JP4.13
  Bottom 0.127: v39.13,13.94 40.43,12.65
N$23
  Top 0.102: U$1.H7 38.24,19.19 38.22,19.16 38.22,18.99 40.59,16.67 40.59,15.71 39.69,14.81
  Top 0.178: JP5.8 36.27,7.8 39.69,11.22 39.69,14.81
N$24
  Top 0.102: U$1.H8 38.64,19.23 | 41.66,10.17 39.7,8.21 39.7,6.51 JP5.9
  Top 0.127: 38.64,19.23 39.73,18.13 41.66,16.21 41.66,10.17
  Bottom 0.102: JP5.9 38.49,5.26
N$25  (via drill 0.13 pad 0.25 layers 1-2, 0.2 pad 0.38)
  Top 0.102: U$1.D7
  Route2 0.102: U$1.D7 42.6,20.83 v46.07,24.3
  Bottom 0.102: v46.07,24.3 JP4.5
  other vias: 38.24,20.84
N$26  (via drill 0.13 layers 1-2, 0.13 pad 0.25 layers 1-2, 0.13 pad 0.25 layers 2-3, 0.2 pad 0.38)
  Top 0.102: U$1.G6
  Top 0.127: JP5.2 28.29,12.83 v32.61,17.15
  Route2 0.076: U$1.G6
  Route2 0.102: U$1.G6 | U$1.G6 37.85,18.98 38.13,18.69 38.13,18.42 | v32.61,17.15 arc-90 v32.62,17.14 v32.61,17.14
  Route2 0.127: 38.13,18.42 38.14,16.94 37.62,16.42 v37.5,16.42
  Route3 0.127: v32.61,17.14 34.72,17.14 35.44,16.42 v37.5,16.42
  other vias: 37.84,19.64
N$27  (via drill 0.13 layers 1-2)
  Top 0.076: v37.44,19.64 U$1.G5
  Top 0.102: U$1.G5 v37.44,19.64
  Route2 0.102: 28.6,5.26 JP5.1 | 37.81,18.68 37.7,18.79 37.44,19.1 U$1.G5
  Route2 0.127: 28.6,5.26 28.6,6.39 29.48,7.28 29.48,12.06 32.88,15.46 36.33,15.46 37.12,16.25 37.12,16.62 37.81,17.33 37.81,18.68
N$28  (via drill 0.13 layers 1-2, 0.2 pad 0.38)
  Top 0.102: U$1.G4 v37.04,19.64
  Route2 0.102: v37.04,19.64 U$1.G4 37.04,19.14 37.04,17.66 v37.03,17.41
  Bottom 0.102: 40.01,14.43 47.02,14.43 48.02,15.43 50.98,15.43 52.26,14.15 JP4.14
  Bottom 0.127: v37.03,17.41 40.01,14.43
N$29  (via drill 0.13 layers 1-2, 0.13 pad 0.25 layers 1-2)
  Top 0.102: U$1.G2 v36.24,19.63 U$1.G2 | v36.2,17.06 36.2,15.41 R3.2
  Route2 0.102: U$1.G2 36.23,19.62 U$1.G2 36.2,19.64 v36.2,17.06
N$31
  Top 0.102: U$1.D8 39.27,20.84 39.39,20.96
  Top 0.127: 39.39,20.96 45.23,20.96 47.38,23.12 50.6,23.12
  Top 0.178: 50.6,23.12 51.89,24.41 52.42,24.41 JP4.6
N$33  (via drill 0.13 layers 2-3, 0.13 pad 0.25 layers 1-2, 0.2 pad 0.38)
  Top 0.076: U$1.E4
  Top 0.102: U$1.E4
  Route2 0.076: U$1.E4 37.03,20.44 U$1.E4
  Route3 0.076: U$1.E4 37.03,20.44 U$1.E4
  Route3 0.102: U$1.E4 36.51,19.91 34.29,19.9 v34.08,20.11
  Bottom 0.102: 41.5,20.43 47.13,20.43 | 40.26,20.44 34.41,20.44 v34.08,20.11
  Bottom 0.127: 40.26,20.44 41.5,20.43 | JP4.7 49.24,21.13 47.83,21.13 47.13,20.43
  other vias: 37.04,20.44 37.04,20.44
N$35  (via drill 0.13 layers 1-2, 0.13 layers 2-3, 0.2 pad 0.38)
  Top 0.102: U$1.E6 37.82,20.44 U$1.E6 | 40.23,9.58 JP5.10
  Top 0.127: v40.23,13.49 40.23,9.58
  Route2 0.076: U$1.E6 37.82,20.46 U$1.E6
  Route2 0.102: U$1.E6
  Route3 0.076: U$1.E6 37.82,20.45 37.88,20.45
  Route3 0.102: 37.88,20.45 38.53,21.1 38.92,21.1 39.39,21.57 39.99,21.57 41.75,21.57 42.61,20.7
  Route3 0.127: 42.61,20.7 42.61,16.55 40.23,14.16 v40.23,13.49
  other vias: 37.84,20.44 37.84,20.44
N$36  (via drill 0.13 layers 1-2)
  Top 0.102: U$1.E7
  Route2 0.102: U$1.E7 39.37,20.44 40.53,20.44 40.99,20.11 40.99,18.95 40.99,18.82
  Route2 0.127: 40.99,18.82 JP5.12
  other vias: 38.24,20.44
N$37
  Top 0.178: U$1.E8 42.15,20.44
  Top 0.254: 42.15,20.44 44.79,17.8 44.79,6.15 43.91,5.26 JP5.13
N$38  (via drill 0.13 layers 1-2, 0.2 pad 0.38)
  Top 0.102: U$1.F3 36.63,20.03 U$1.F3
  Route2 0.102: U$1.F3 36.34,20.34 34.39,20.34 34.35,20.34 33.62,21.07 33.3,21.07 v31.21,23.16
  Bottom 0.127: v31.21,23.16 31.55,23.48 31.6,23.54 37.41,23.54 37.98,22.97 51.23,22.97 JP4.8
  other vias: 36.64,20.04
N$39  (via drill 0.13 pad 0.25 layers 1-2, 0.13 pad 0.25 layers 2-3, 0.2 pad 0.38)
  Top 0.102: U$1.F4 v37.04,20.04
  Route2 0.102: v37.04,20.04
  Route3 0.102: v37.04,20.04 U$1.F4 37.03,19.9 37.69,19.24 v41.54,19.24
  Bottom 0.102: JP4.9
  Bottom 0.127: v41.54,19.24 JP4.9
N$40  (via drill 0.13 layers 1-2, 0.13 layers 2-3, 0.2 pad 0.38)
  Top 0.102: U$1.F5 | U$1.F5
  Route2 0.076: v37.43,20.05 v37.44,20.04 37.45,20.03
  Route2 0.102: U$1.F5 v37.44,20.04 v37.43,20.05
  Route3 0.076: v37.44,20.04 37.44,20.03 37.42,20.03
  Route3 0.102: 37.42,20.03 37.42,19.99 37.47,19.99 37.8,19.66 41.6,19.66 | 41.6,19.66 | 41.6,19.66 v41.95,19.66
  Bottom 0.102: v41.95,19.66 47.91,19.66 | 52.42,19.66 JP4.10
  Bottom 0.127: 52.42,19.66 51.72,20.36 48.61,20.36 47.91,19.66
  other vias: 37.44,20.04
N$41  (via drill 0.13 layers 1-2, 0.13 layers 2-3, 0.2 pad 0.38)
  Top 0.102: U$1.F6
  Route2 0.076: 37.85,20.03 U$1.F6
  Route2 0.102: U$1.F6 37.85,20.03 | JP5.5 34.6,6.49 34.6,11.95 | 40.1,19.23 40.38,19.5 v40.38,20.03
  Route2 0.127: 34.6,11.95 40.1,17.45 40.1,19.23
  Route3 0.076: U$1.F6 37.84,20.03 37.85,20.03
  Route3 0.102: 37.85,20.03 39.3,20.03 v40.38,20.03
  other vias: 37.84,20.04 37.84,20.04
N$42  (via drill 0.13 layers 1-2)
  Top 0.102: U$1.F7 v38.24,20.04
  Route2 0.102: v38.24,20.04 38.29,20.1 38.75,20.1 38.94,19.91 38.94,18.34 38.93,18.33 | 33.37,11.19 JP5.6
  Route2 0.127: 38.93,18.33 38.93,16.74 33.37,11.19
N$47
  Top 0.127: TPS7323.4 12.94,25.65
  Top 0.254: 12.94,25.65 12.94,22.84 12.79,22.68 C11.2
N$48
  Top 0.254: TPS7323.5 13.35,27.95 L1.2
RX_UART  (via drill 0.13 layers 1-2, 0.2 pad 0.38)
  Top 0.102: U$1.G3
  Route2 0.102: U$1.G3 36.64,19.63 v36.64,18.48
  Bottom 0.125: v36.64,18.48 36.96,18.8 38.95,18.8 39.33,18.42 40.17,18.42 40.44,18.69 48.77,18.69 49.58,17.88
  Bottom 0.127: 49.58,17.88 51.67,17.88 52.42,17.13 JP4.12
  other vias: 36.64,19.64
TCK  (via drill 0.13 layers 1-2, 0.2 pad 0.38)
  Top 0.102: U$1.C2
  Route2 0.102: U$1.C2 36.23,21.23 | 36.23,21.23 U$1.C2 | 36.23,21.23 35.7,21.23 34.68,22.25
  Route2 0.127: 34.68,22.25 34.64,22.3 v33.94,22.3
  Bottom 0.127: v33.94,22.3 33.9,22.3 21.92,22.3 JP1.7
  other vias: 36.24,21.24
TDI  (via drill 0.13 layers 1-2, 0.13 layers 2-3, 0.13 pad 0.25 layers 1-2, 0.13 pad 0.25 layers 2-3)
  Top 0.102: U$1.D4 | v34.46,21.73 33.98,21.73 30.82,24.89
  Top 0.178: JP1.3 21.62,24.89 30.82,24.89
  Route2 0.076: 37.01,20.84 U$1.D4
  Route2 0.102: U$1.D4 37.02,20.84 37.02,20.83 37.01,20.84 | v34.46,21.73 v34.47,21.73 v34.46,21.73
  Route3 0.076: U$1.D4 37.03,20.85
  Route3 0.102: 37.03,20.85 36.54,20.85 36.03,21.36 35.67,21.72 v34.46,21.73
  other vias: 37.04,20.84 37.04,20.84
TDO  (via drill 0.13 layers 1-2)
  Top 0.076: U$1.D3
  Top 0.102: U$1.D3
  Route2 0.089: 36.35,20.56 34.58,20.55
  Route2 0.102: U$1.D3 36.35,20.56 | JP1.1 21.6,29.6 25.51,29.6 34.47,20.64 34.53,20.57 34.58,20.55
  other vias: 36.64,20.84
TEST  (via drill 0.13 pad 0.25 layers 1-2, 0.13 pad 0.25 layers 2-3, 0.2 pad 0.38)
  Top 0.076: U$1.E3
  Top 0.102: U$1.E3
  Route2 0.076: U$1.E3
  Route2 0.089: U$1.E3 36.59,20.43 U$1.E3
  Route3 0.102: U$1.E3 35.11,20.43 35.04,20.5 | 34.48,21.07 33.01,21.07
  Route3 0.127: 35.04,20.5 34.48,21.07 | 33.01,21.07 32.21,21.87 v29.4,21.87
  Bottom 0.127: v29.4,21.87 28.43,20.9 JP1.8
  other vias: 36.64,20.44 36.64,20.44
TX_UART  (via drill 0.2 pad 0.38)
  Top 0.102: 35.87,18.47 v35.81,18.47 35.93,18.47 36.64,19.18 U$1.H3
  Bottom 0.102: v35.81,18.47 36.24,18.04 46.43,18.04
  Bottom 0.127: 46.43,18.04 48.54,18.04 JP4.11
VCC
  Top 0.127: 7.38,32.14 C10.2 | 10.37,25.67 TPS7323.3
  Top 0.254: 10.37,25.67 9.26,25.67 9.05,25.89 9.05,27.45 9.25,27.65 TPS7323.1
  Top 0.406: C9.2 7.38,32.14 | 9.25,27.65 9.25,31.58 C9.2 | JP6.4 8.64,32.14 C9.2
VCC2
  Top 0.127: U$3.A2 U$3.B2
  Top 0.178: 18.18,7.54 18.27,7.44 C15.2
  Top 0.203: U$3.B2 16.97,5.98 | 18.18,7.54 U$3.A2
  Top 0.254: 16.97,5.98 JP7.4
VDD  (via drill 0.2 pad 0.38)  (1 unrouted)
  Top 0.076: v45.88,12.01 v45.88,12.02 v45.89,12.02
  Top 0.102: U$1.A7 38.24,22.17 39.17,23.11 39.28,23.21 39.85,23.21 41.16,24.52 C6.2 | U$1.A3 36.64,22.22 33.94,24.92 v33.94,26.15 | U$1.H5 37.44,18.6 v37.44,18.4 | C1.2 30.72,20.13 C2.2 | v39.24,15.97 39.23,16.4 C7.2 | R1.2 11.32,12.11 | v45.89,12.02 v45.88,12.02 | 30.93,19.49 30.79,19.35 v30.51,19.35
  Top 0.127: JP3.16 47.01,37.01 48.78,35.25 48.78,32.38 v48.5,32.11 | C6.2 v42.17,24.52
  Top 0.356: 11.32,12.11 JP8.2
  Top 0.406: R1.2 11.4,14.79 v12.59,15.97
  Route15 0.102: v30.51,19.35 31.16,19.32
  Route15 0.406: v12.59,15.97 15.73,19.12 15.73,28.99 17.69,30.95 19.12,30.95 | 19.3,30.95 19.12,30.95 | v26.05,28.43 25.85,28.43 23.34,30.95 19.3,30.95 | 19.3,30.95 19.12,30.95 | 19.3,30.95 21.4,33.04 JP2.2
  Bottom 0.102: v33.94,26.15 33.93,26.14
  Bottom 0.127: v48.5,32.11 48.5,32.09 48.49,32.08
  Bottom 0.2: JP4.16 48.61,7.8 JP5.16 45.88,8 v45.88,12.01
  pour Route15 (isolate 0.152): 25.56,32.56 48.86,32.56 48.86,10.96 25.57,10.96 25.57,32.53
VDD_BGA
  Top 0.254: U$3.B1 15.93,7.14 14.8,8.27 C14.2
  Top 0.381: 6.89,8.28 JP8.3
  Top 0.406: C14.2 6.89,8.28
VDD_TARGET
  Top 0.305: JP1.4 24.78,27.7 24.78,32.04
  Top 0.406: JP2.3 24.78,37.32 24.78,32.04
VDD_TOOL
  Top 0.305: JP1.2 23.15,28.61
  Bottom 0.406: JP1.2 23.07,29.43 22.27,30.23 19.86,30.23 19.12,30.97 18.86,31.23 JP2.1
VDD_TPS  (via drill 0.2 pad 0.38)
  Top 0.203: C13.2 14.9,32.77 L1.1 13.59,31.47 | C12.2 14.92,33.8
  Top 0.254: 14.92,33.8 C13.2
  Top 0.305: v15.61,31.47 15.37,31.23 L1.1
  Bottom 0.406: JP8.1 9.12,18.18 9.12,24.16 15.61,30.64 v15.61,31.47
XIN  (via drill 0.2 pad 0.38)
  Top 0.102: 36.33,24.47 U$2.P$1 36.44,24.33 37.44,23.33 37.44,23.3 37.44,23.22 U$1.A5 | v35.6,25.23 36.77,25.23 36.77,23.89
  Top 0.178: U$2.P$1 36.33,23.96 | U$2.P$1 36.47,24.33 | 36.77,23.61 36.77,23.89 U$2.P$1
  Bottom 0.127: v35.6,25.23 36.35,25.85 C5.1
XOUT  (via drill 0.2 pad 0.38)
  Top 0.102: U$1.A6 37.84,23.22 37.84,23.23 37.84,23.34 U$2.P$2
  Top 0.127: U$2.P$2 38.78,24.38 v38.78,27.14
  Top 0.178: 38.47,23.97 38.43,23.97 | U$2.P$2 38.47,23.97 | 38.47,23.97 38.47,23.68
  Bottom 0.127: v38.78,27.14 38.83,27.09 C4.1

### Text on the board
tPlace: V_TL | VDD | V_TG | 1 | 1 | VCC | GND | VCC2 | GND | 1